# Altium schematic sheet main.SchDoc
size 420 x 297 mm; Address1: Address1; Address2: Address2; Address3: Address3; Address4: Address4; SheetNumber: 1; Scale: 1:1; Разраб.: Иванов; Обозначение документа: АБВГ.123456.001 Э3; Пров.: Петров; Утв.: Сидоров; Наименование организации: ОАО "Концерн "МПО-Гидроприбор"; Перв. применение: АБВГ.123456.000; Наименование изделия 1: MAiN; Наименование изделия 2: Схема электрическая; Наименование изделия 3: принципиальная; Нач. отд.: Нач. отд.; Фамилия нач. отд.: Сидоров
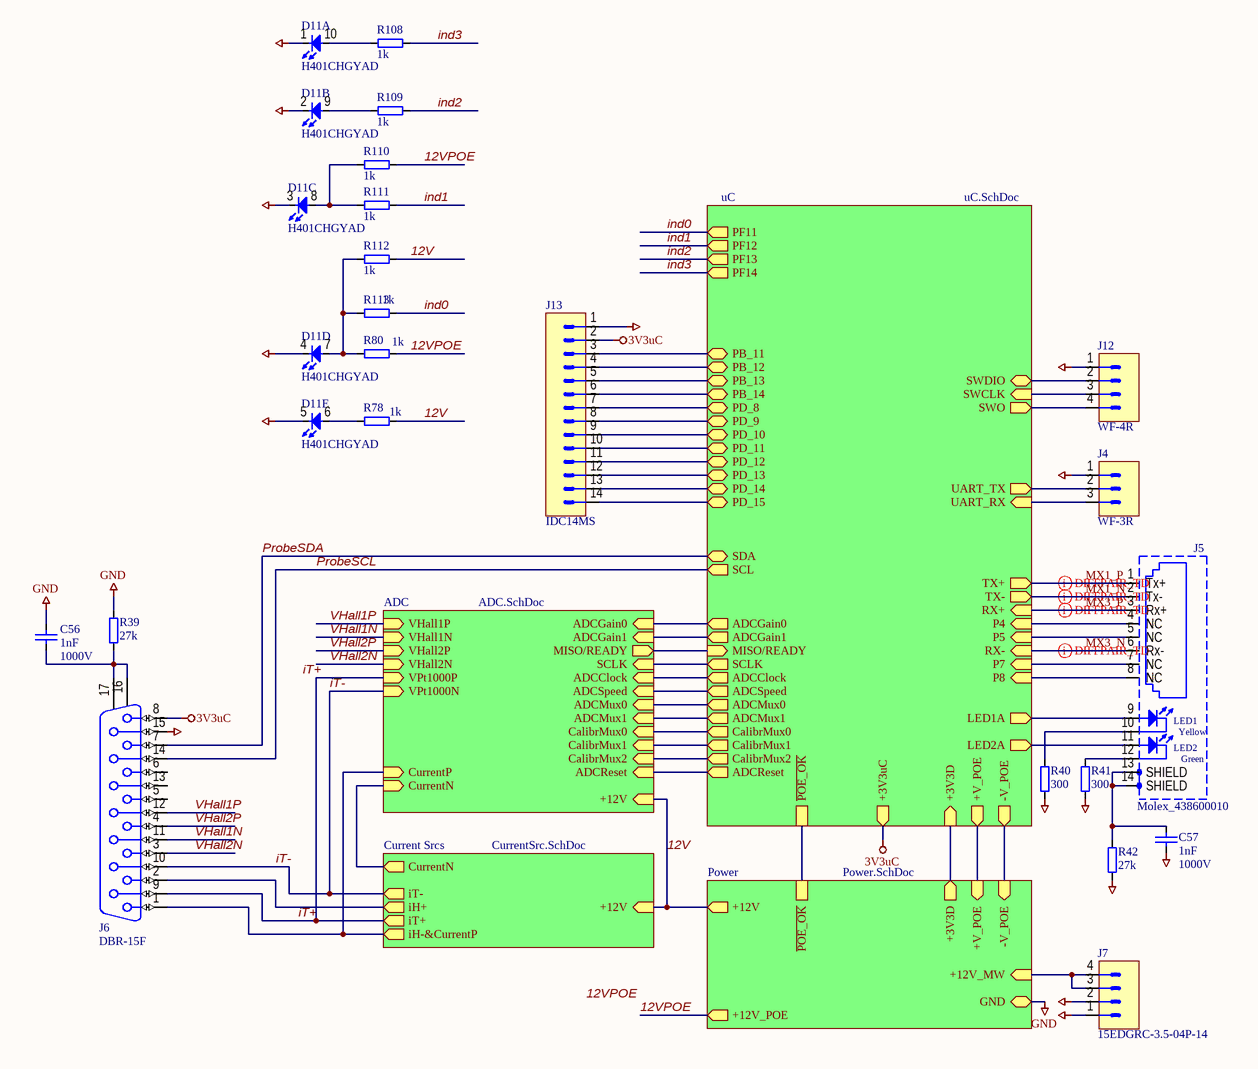
[diagram p0: main.SchDoc]

## Parts
C56  1nF  Voltage: 1000V  [CAPC1206]
C57  1nF  Voltage: 1000V  [CAPC1206]
D11  H401CHGYAD  [H401CHGYAD_LED_CB]  (parts A,B,C,D,E of 5)
J4  WF-3R  [MOLEX_22-05-7038]
J5  Molex_438600010  [Molex-43860-0010]
J6  DBR-15F  [AMPHENOL_L717DFA15S1ATN]
J7  15EDGRC-3.5-04P-14  [TE_284512-4]
J12  WF-4R  [MOLEX_WF4-angle]
J13  IDC14MS  [3M_2514-6002RB]
R39  27k  [SMD0805RES]
R40  300  [RESC1608X64N]
R41  300  [RESC1608X64N]
R42  27k  [SMD0805RES]
R78  1k  [SMD0805RES]
R80  1k  [SMD0805RES]
R108  1k  [SMD0805RES]
R109  1k  [SMD0805RES]
R110  1k  [SMD0805RES]
R111  1k  [SMD0805RES]
R112  1k  [SMD0805RES]
R113  1k  [SMD0805RES]

## Sub-sheets
ADC = ADC.SchDoc: ADCGain1 (in), ADCGain0 (in), MISO/READY (out), SCLK (in), ADCClock (in), ADCSpeed (in), ADCMux0 (in), ADCMux1 (in), CalibrMux0 (in), CalibrMux1 (in), CalibrMux2 (in), +12V (in), VHall1P (in), VHall1N (in), VHall2P (in), VHall2N (in), CurrentP (in), CurrentN (in), VPt1000P (in), VPt1000N (in), ADCReset (in)
Current Srcs = CurrentSrc.SchDoc: +12V (in), iH-&CurrentP (out), iT+ (out), iH+ (out), CurrentN (out), iT- (out)
Power = Power.SchDoc: +V_POE (in), -V_POE (in), +12V_MW (in), GND (bidir), +3V3D (out), +12V (out), ~{POE_OK}, +12V_POE (out)
uC = uC.SchDoc: TX+ (out), TX- (out), RX+ (in), P4 (in), P5 (in), RX- (in), P7 (in), P8 (in), LED1A (out), LED2A (out), +V_POE (out), -V_POE (out), +3V3D (in), UART_TX (out), UART_RX (in), ADCGain0 (out), ADCGain1 (out), MISO/READY (in), SCLK (out), ADCClock (out), ADCSpeed (out), ADCMux0 (out), ADCMux1 (out), CalibrMux0 (out), CalibrMux1 (out), CalibrMux2 (out), SDA (bidir), SCL (out), ADCReset (out), ~{POE_OK}, +3V3uC (out), SWO (out), SWCLK (in), SWDIO (bidir), PD_15 (bidir), PD_14 (bidir), PD_13 (bidir), PD_12 (bidir), PD_11 (bidir), PD_10 (bidir), PD_9 (bidir), PD_8 (bidir), PB_14 (bidir), PB_13 (bidir), PB_12 (bidir), PB_11 (bidir), PF11 (out), PF12 (out), PF13 (out), PF14 (out)

## Nets
3V3uC: J6.8 J13.2 ; sheet uC/+3V3uC
GND: C56.1 C57.1 D11.1(C1) D11.2(C2) D11.3(C3) D11.4(C4) D11.5(C5) J4.1 J6.15 J7.1 J7.2 J12.1 J13.1 R39.2 R40.1 R41.1 R42.1 ; sheet Power/GND
12V: R78.2 R112.2 ; sheet ADC/+12V, sheet Current Srcs/+12V, sheet Power/+12V
12VPOE: R80.2 R110.2 ; sheet Power/+12V_POE
ind0: R113.2 ; sheet uC/PF11
ind1: R111.2 ; sheet uC/PF12
ind2: R109.2 ; sheet uC/PF13
ind3: R108.2 ; sheet uC/PF14
iT+: J6.9 ; sheet ADC/VPt1000P, sheet Current Srcs/iT+
iT-: J6.10 ; sheet ADC/VPt1000N, sheet Current Srcs/iT-
MX1_N: J5.2(Tx-) ; sheet uC/TX-
MX1_P: J5.1(Tx+) ; sheet uC/TX+
MX3_N: J5.6(Rx-) ; sheet uC/RX-
MX3_P: J5.3(Rx+) ; sheet uC/RX+
ProbeSCL: J6.14 ; sheet uC/SCL
ProbeSDA: J6.7 ; sheet uC/SDA
VHall1N: J6.11 ; sheet ADC/VHall1N
VHall1P: J6.12 ; sheet ADC/VHall1P
VHall2N: J6.3 ; sheet ADC/VHall2N
VHall2P: J6.4 ; sheet ADC/VHall2P
NetC56_2: C56.2 J6.16 J6.17 R39.1
NetC57_2: C57.2 J5.13(SHIELD) J5.14(SHIELD) R42.2
NetD11_6: D11.6(A5) R78.1
NetD11_7: D11.7(A4) R80.1 R112.1 R113.1
NetD11_8: D11.8(A3) R110.1 R111.1
NetD11_9: D11.9(A2) R109.1
NetD11_10: D11.10(A1) R108.1
NetJ4_2: J4.2 ; sheet uC/UART_TX
NetJ4_3: J4.3 ; sheet uC/UART_RX
NetJ5_4: J5.4(NC) ; sheet uC/P4
NetJ5_5: J5.5(NC) ; sheet uC/P5
NetJ5_7: J5.7(NC) ; sheet uC/P7
NetJ5_8: J5.8(NC) ; sheet uC/P8
NetJ5_9: J5.9(ALED1) ; sheet uC/LED1A
NetJ5_10: J5.10(CLED1) R40.2
NetJ5_11: J5.11(ALED2) ; sheet uC/LED2A
NetJ5_12: J5.12(CLED2) R41.2
NetJ6_1: J6.1 ; sheet ADC/CurrentP, sheet Current Srcs/iH-&CurrentP
NetJ6_2: J6.2 ; sheet Current Srcs/iH+
NetJ7_3: J7.3 J7.4 ; sheet Power/+12V_MW
NetJ12_2: J12.2 ; sheet uC/SWDIO
NetJ12_3: J12.3 ; sheet uC/SWCLK
NetJ12_4: J12.4 ; sheet uC/SWO
NetJ13_3: J13.3 ; sheet uC/PB_11
NetJ13_4: J13.4 ; sheet uC/PB_12
NetJ13_5: J13.5 ; sheet uC/PB_13
NetJ13_6: J13.6 ; sheet uC/PB_14
NetJ13_7: J13.7 ; sheet uC/PD_8
NetJ13_8: J13.8 ; sheet uC/PD_9
NetJ13_9: J13.9 ; sheet uC/PD_10
NetJ13_10: J13.10 ; sheet uC/PD_11
NetJ13_11: J13.11 ; sheet uC/PD_12
NetJ13_12: J13.12 ; sheet uC/PD_13
NetJ13_13: J13.13 ; sheet uC/PD_14
NetJ13_14: J13.14 ; sheet uC/PD_15
(unnamed): sheet ADC/ADCGain1, sheet uC/ADCGain1
(unnamed): sheet ADC/ADCGain0, sheet uC/ADCGain0
(unnamed): sheet ADC/MISO/READY, sheet uC/MISO/READY
(unnamed): sheet ADC/SCLK, sheet uC/SCLK
(unnamed): sheet ADC/ADCClock, sheet uC/ADCClock
(unnamed): sheet ADC/ADCSpeed, sheet uC/ADCSpeed
(unnamed): sheet ADC/ADCMux0, sheet uC/ADCMux0
(unnamed): sheet ADC/ADCMux1, sheet uC/ADCMux1
(unnamed): sheet ADC/CalibrMux0, sheet uC/CalibrMux0
(unnamed): sheet ADC/CalibrMux1, sheet uC/CalibrMux1
(unnamed): sheet ADC/CalibrMux2, sheet uC/CalibrMux2
(unnamed): sheet ADC/CurrentN, sheet Current Srcs/CurrentN
(unnamed): sheet ADC/ADCReset, sheet uC/ADCReset
(unnamed): sheet uC/+V_POE, sheet Power/+V_POE
(unnamed): sheet uC/-V_POE, sheet Power/-V_POE
(unnamed): sheet uC/+3V3D, sheet Power/+3V3D
(unnamed): sheet uC/~{POE_OK}, sheet Power/~{POE_OK}

Not connected (* = marked no-connect by the designer): J6 5 6 13

## Layout directives
differential pair: MX1_N, MX1_P, MX3_N, MX3_P

## Notes on the sheet
- Labels drawn without touching a wire or pin: 12VPOE, iT+
- Перв. примен.
- Справ. №
- Подп. и дата
- Инв. № дубл.
- Взам. инв. №
- Разраб.
- Изм.
- Лист
- № докум.
- Подп.
- Дата
- Лит.
- Масса
- Масштаб
- Пров.
- Т.контр.
- Листов
- Инв. № подл.
- Утв.
- Н.контр.
- Копировал
- Формат А3
- (in symbol Molex_438600010) LED1; Yellow; LED2; Green

## Library data of the parts
C56 C57 = C1206: Чип конденсатор 1206; Vendor: Vishay; DielectricType: X5R; SMD Solders: 2; Solder Option: RM; Tolerance: 1%; Pkg: SMD1206; Device: Cap1206; Value: 1nF; Price: 2
D11 = H401CHGYAD: 4LEDs сборка; Vendor: BIVAR; Value: HGYAD; SMD Solders: 0; Solder Option: RM; Pkg: SMD0603; Device: H401C; THD Solders: 8; Price: 700; Name to order: H401CHGYAD
J4 = WF3R: Вилка  WF3 угловая; Vendor: Confly; SMD Solders: 0; Solder Option: RM; THD Solders: 3; Price: 20; Device: WF-3R; Name to order: WF-3R
J5 = Molex_438600010: 1 Port, 8 Positions, CAT5 RJ45 Modular Connector With Yellow And Green fibers for LEDs; Vendor: Molex; SMD Solders: 4; Solder Option: RM; THD Solders: 10; Price: 320; Pkg: Molex_438600010; Device: Molex_438600010; Name to order: 438600010
J6 = D_SUB_15F: Вилка  DSUB 9 угловая; Vendor: Connfly; SMD Solders: 0; Solder Option: RM; THD Solders: 17; Name to order: DRB- 15MA (DBR-15F) (DS1037-15F); Price: 50; Device: DBR-15F
J7 = 15EDGRC-3.5-04P-14: Вилка  WF4; Vendor: Degson; SMD Solders: 0; Solder Option: RM; THD Solders: 4; Price: 50; Device: 15EDGRC-3.5-04P-14; Name to order: 15EDGRC-3.5-04P-14
J12 = WF4R: Вилка  WF4 угловая; Vendor: Confly; SMD Solders: 0; Solder Option: RM; THD Solders: 4; Price: 20; Device: WF-4R; Name to order: WF-4R
J13 = IDC14MS: Вилка  14конт., шаг: 2.54мм; Vendor: Connfly; SMD Solders: 0; Solder Option: RM; THD Solders: 14; Name to order: BH-14, DS1013-14S, IDC-14MS; Price: 30; Device: IDC14MS
R39 R42 R78 R80 R108-R113 = R0805: Чип резистор 0805; Vendor: Vishay; SMD Solders: 2; Solder Option: RM; TC: 100ppm/C; Tolerance: 1%; Pkg: SMD0805; Pwr: 125mW; Device: Res0805; Price: 2
  R39 R42: Value: 27k
  R78 R80 R108-R113: Value: 1k
R40 R41 = R0603: Чип резистор 0603; Vendor: Vishay; SMD Solders: 2; Solder Option: RM; TC: 100ppm/C; Tolerance: 1%; Pkg: SMD0603; Pwr: 60mW; Device: Res603; Price: 2; Value: 300